# EAGLE schematic PowerBoard (EAGLE 9.4.2)
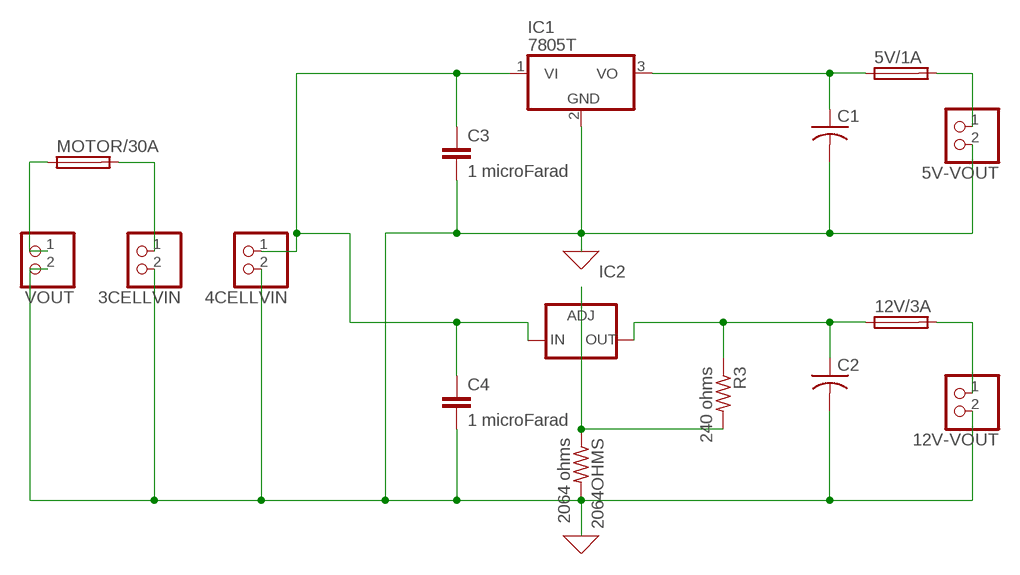
[diagram p0: schematic, sheet 1]

## Parts
3CELLVIN  JST_2PIN-THM  [JST-PH-2-THM]
4CELLVIN  JST_2PIN-THM  [JST-PH-2-THM]
5V-VOUT  JST_2PIN-THM  [JST-PH-2-THM]
5V/1A  GSH15  [GSH15]
12V-VOUT  JST_2PIN-THM  [JST-PH-2-THM]
12V/3A  GSH15  [GSH15]
2064OHMS  2064 ohms  FLIPFLOP-RES  [0805-THM]
C1  C-US050-035X075  [C050-035X075]
C2  C-US050-035X075  [C050-035X075]
C3  1 microFarad  C5/2.5  [C5B2.5]
C4  1 microFarad  C5/2.5  [C5B2.5]
IC1  7805T  [TO220H]
IC2  LM337TS  [337TS]
MOTOR/30A  GSH15  [GSH15]
R3  240 ohms  FLIPFLOP-RES  [0805-THM]
VOUT  JST_2PIN-THM  [JST-PH-2-THM]

## Nets
0: 3CELLVIN.2 4CELLVIN.2 5V-VOUT.2 12V-VOUT.2 2064OHMS.2 C1.2 C2.2 C3.2 C4.2 IC1.2(GND) VOUT.2 ; supply symbol labelled GND
3CELLVIN: 3CELLVIN.1 MOTOR/30A.2
N$1: 5V/1A.1 C1.1 IC1.3(VO)
N$2: 5V-VOUT.1 5V/1A.2
N$3: 12V/3A.1 C2.1 IC2.3(OUT) R3.1
N$4: 2064OHMS.1 IC2.1(ADJ) R3.2
N$5: 12V-VOUT.1 12V/3A.2
N$6: MOTOR/30A.1 VOUT.1
N$7: 4CELLVIN.1 C3.1 C4.1 IC1.1(VI) IC2.2(IN)

## Library data of the parts
3CELLVIN 4CELLVIN 5V-VOUT 12V-VOUT VOUT = adafruit:JST_2PIN: JST 2-Pin Connectors of various flavors SMT-RA (S2B-PH-SM4) 4UConnector #17311 SMT (B2B-PH-SM4) THM-RA (S2B-PH) THM (B2B-PH)
5V/1A 12V/3A MOTOR/30A = fuse:GSH15: FUSE HOLDER grid 15mm, 19649 Wickmann; MPN: 64900001039; OC_FARNELL: 1271673; OC_NEWARK: 02P0318
2064OHMS R3 = adafruit:FLIPFLOP-RES: Flip Flop resistor An 0805 resistor inside a standard 1/4W 5% resistor. Makes for easy mods
C1 C2 = adafruit:C-US: CAPACITOR, American symbol
C3 C4 = capacitor-wima:C: CAPACITOR naming: grid - package width
IC1 = linear:78*: Positive VOLTAGE REGULATOR Source: http://cache.national.com/ds/LM/LM78L05.pdf http://www.fairchildsemi.com/ds/LM/LM7805.pdf
IC2 = v-reg-3:LM337TS: VOLTAGE REGULATOR